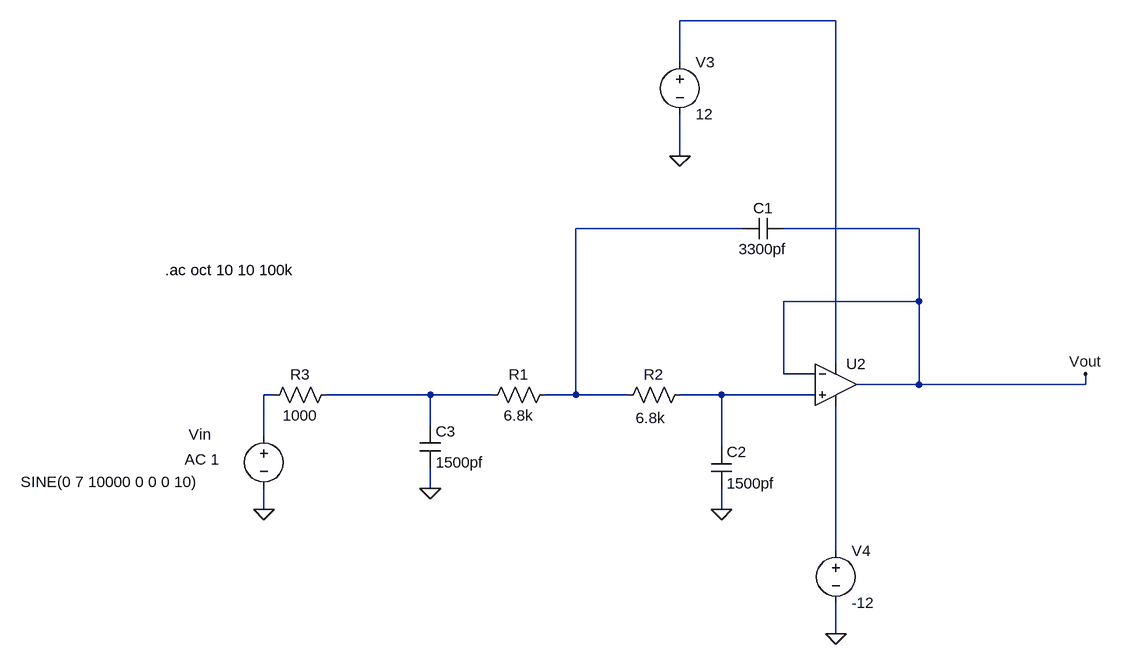
[diagram p0: schematic MV_DAC_Filter.asc]
MV_DAC_Filter.asc, the LTspice schematic file:
Version 4
SHEET 1 880 680
WIRE 272 -368 32 -368
WIRE 32 -304 32 -368
WIRE 32 -160 32 -224
WIRE 128 -48 -128 -48
WIRE 400 -48 192 -48
WIRE 400 64 400 -48
WIRE 400 64 192 64
WIRE 272 160 272 -368
WIRE 192 176 192 64
WIRE 240 176 192 176
WIRE 400 192 400 64
WIRE 400 192 304 192
WIRE 656 192 656 176
WIRE 656 192 400 192
WIRE -592 208 -608 208
WIRE -352 208 -512 208
WIRE -256 208 -352 208
WIRE -128 208 -128 -48
WIRE -128 208 -176 208
WIRE -48 208 -128 208
WIRE 96 208 32 208
WIRE 240 208 96 208
WIRE -352 256 -352 208
WIRE -608 272 -608 208
WIRE 96 288 96 208
WIRE -352 352 -352 320
WIRE -608 384 -608 352
WIRE 96 384 96 352
WIRE 272 448 272 224
WIRE 272 576 272 528
FLAG 96 384 0
FLAG -608 384 0
FLAG 656 176 Vout
FLAG 32 -160 0
FLAG 272 576 0
FLAG -352 352 0
SYMBOL res -160 192 R90
WINDOW 0 0 56 VBottom 2
WINDOW 3 32 56 VTop 2
SYMATTR InstName R1
SYMATTR Value 6.8k
SYMBOL voltage -608 256 R0
WINDOW 3 -374 86 Left 2
WINDOW 123 -122 51 Left 2
WINDOW 39 0 0 Left 2
WINDOW 0 -116 13 Left 2
SYMATTR Value SINE(0 7 10000 0 0 0 10)
SYMATTR Value2 AC 1
SYMATTR InstName Vin
SYMBOL Opamps\\UniversalOpamp2 272 192 R0
SYMATTR InstName U2
SYMBOL voltage 32 -320 R0
WINDOW 123 0 0 Left 2
WINDOW 39 0 0 Left 2
SYMATTR InstName V3
SYMATTR Value 12
SYMBOL voltage 272 432 R0
WINDOW 123 0 0 Left 2
WINDOW 39 0 0 Left 2
SYMATTR InstName V4
SYMATTR Value -12
SYMBOL cap 128 -32 R270
WINDOW 0 32 32 VTop 2
WINDOW 3 0 32 VBottom 2
SYMATTR InstName C1
SYMATTR Value 3300pf
SYMBOL cap 80 288 R0
SYMATTR InstName C2
SYMATTR Value 1500pf
SYMBOL res 48 192 R90
WINDOW 0 0 56 VBottom 2
WINDOW 3 36 61 VTop 2
SYMATTR InstName R2
SYMATTR Value 6.8k
SYMBOL res -496 192 R90
WINDOW 0 0 56 VBottom 2
WINDOW 3 32 56 VTop 2
SYMATTR InstName R3
SYMATTR Value 1000
SYMBOL cap -368 256 R0
SYMATTR InstName C3
SYMATTR Value 1500pf
TEXT -760 16 Left 2 !.ac oct 10 10 100k

The netlist it stands for:
* MV_DAC_Filter.asc
R1 N002 N004 6.8k
Vin N003 0 SINE(0 7 10000 0 0 0 10) AC 1
XU2 N005 Vout N001 N006 Vout level.2 Avol=1Meg GBW=10Meg Slew=10Meg ilimit=25m rail=0 Vos=0 phimargin=45 en=0 enk=0 in=0 ink=0 Rin=500Meg  ; pins IN+ IN- V+ V- OUT
V3 N001 0 12
V4 N006 0 -12
C1 N002 Vout 3300pf
C2 N005 0 1500pf
R2 N005 N002 6.8k
R3 N004 N003 1000
C3 N004 0 1500pf
.ac oct 10 10 100k
.lib UniversalOpamps2.sub
.backanno
.end